# Altium schematic sheet at32f415_soc.SchDoc
size A4; DocumentNumber: 2; SheetNumber: 2; SheetTotal: 4
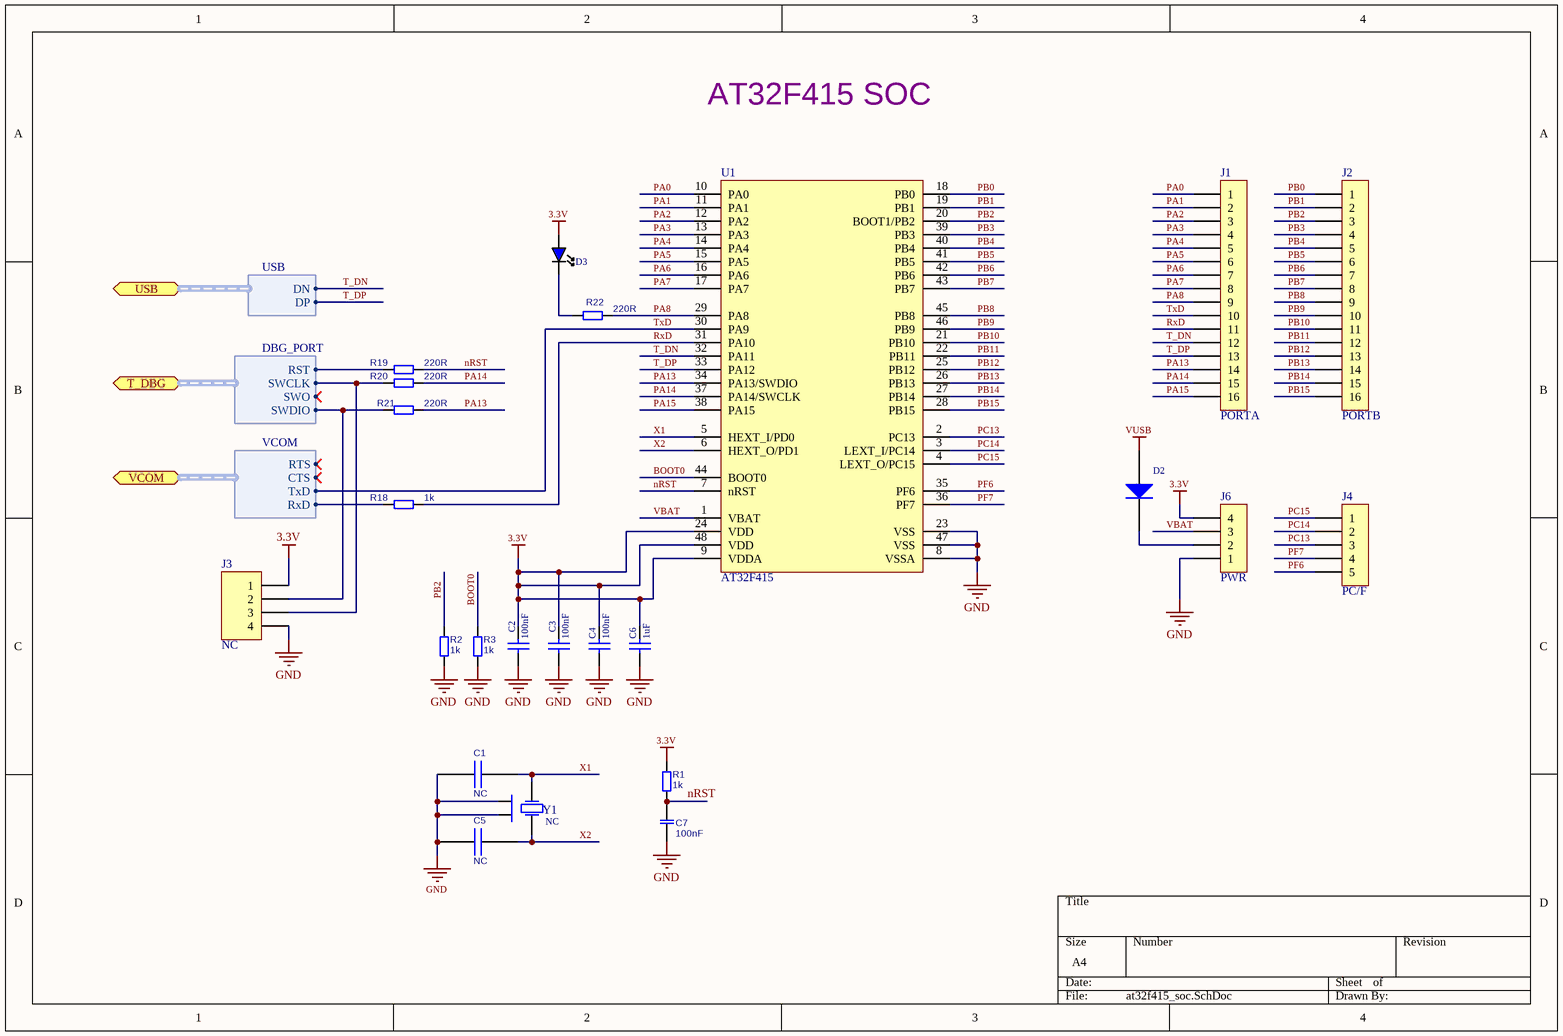
[diagram p0: at32f415_soc.SchDoc]

## Parts
C1  NC  [C0402]  (no BOM)
C2  100nF  [C0402]
C3  100nF  [C0402]
C4  100nF  [C0402]
C5  NC  [C0402]  (no BOM)
C6  1uF  [C0603]
C7  100nF  [C0402]
D2  Diode  [SOD123]  (value not drawn)
D3  User LED  [LED0603]  (value not drawn)
J1  PORTA  [HDR1X16]  (no BOM)
J2  PORTB  [HDR1X16]  (no BOM)
J3  NC  [HDR1X4]  (no BOM)
J4  PC/F  [HDR1X5]  (no BOM)
J6  PWR  [HDR1X4]  (no BOM)
R1  1k  [R0402]
R2  1k  [R0402]
R3  1k  [R0402]
R18  1k  [R0402]
R19  220R  [R0402]
R20  220R  [R0402]
R21  220R  [R0402]
R22  220R  [R0402]
U1  AT32F415  [LQFP48_M]
Y1  NC  [XTAL_3225]  (no BOM)

## Ports
T_DBG (harness DBG_PORT), USB (harness USB), VCOM (harness VCOM)

## Harnesses
DBG_PORT: RST, SWCLK, SWDIO, SWO
VCOM: RTS, CTS, RxD, TxD
USB: DP, DN

## Nets
3.3V: C2.1 C3.1 C4.1 C6.1 D3.A J3.1 J6.4 R1.1(K) U1.9(VDDA) U1.24(VDD) U1.48(VDD)
GND: C1.1(P) C2.2 C3.2 C4.2 C5.1(P) C6.2 C7.1(K) J3.4 J6.1 R2.1(K) R3.2(A) U1.8(VSSA) U1.23(VSS) U1.47(VSS) Y1.2 Y1.4(X2)
VUSB: D2.A
BOOT0: R3.1(K) U1.44(BOOT0)
nRST: C7.2(A) R1.2(A) R19.1(K) U1.7(nRST)
PA0: J1.1 U1.10(PA0)
PA1: J1.2 U1.11(PA1)
PA2: J1.3 U1.12(PA2)
PA3: J1.4 U1.13(PA3)
PA4: J1.5 U1.14(PA4)
PA5: J1.6 U1.15(PA5)
PA6: J1.7 U1.16(PA6)
PA7: J1.8 U1.17(PA7)
PA8: J1.9 R22.1(K) U1.29(PA8)
PA13: J1.14 R21.1(K) U1.34(PA13/SWDIO)
PA14: J1.15 R20.1(K) U1.37(PA14/SWCLK)
PA15: J1.16 U1.38(PA15)
PB0: J2.1 U1.18(PB0)
PB1: J2.2 U1.19(PB1)
PB2: J2.3 R2.2(A) U1.20(BOOT1/PB2)
PB3: J2.4 U1.39(PB3)
PB4: J2.5 U1.40(PB4)
PB5: J2.6 U1.41(PB5)
PB6: J2.7 U1.42(PB6)
PB7: J2.8 U1.43(PB7)
PB8: J2.9 U1.45(PB8)
PB9: J2.10 U1.46(PB9)
PB10: J2.11 U1.21(PB10)
PB11: J2.12 U1.22(PB11)
PB12: J2.13 U1.25(PB12)
PB13: J2.14 U1.26(PB13)
PB14: J2.15 U1.27(PB14)
PB15: J2.16 U1.28(PB15)
PC13: J4.3 U1.2(PC13)
PC14: J4.2 U1.3(LEXT_I/PC14)
PC15: J4.1 U1.4(LEXT_O/PC15)
PF6: J4.5 U1.35(PF6)
PF7: J4.4 U1.36(PF7)
RxD: J1.11 R18.2(A) U1.31(PA10)
T_DN: J1.12 U1.32(PA11) ; port USB.DN
T_DP: J1.13 U1.33(PA12) ; port USB.DP
TxD: J1.10 U1.30(PA9) ; port VCOM.TxD
VBAT: J6.3 U1.1(VBAT)
X1: C1.2(N) U1.5(HEXT_I/PD0) Y1.1(X1)
X2: C5.2(N) U1.6(HEXT_O/PD1) Y1.3(X2)
NetD2_K: D2.K J6.2
NetD3_k: D3.k R22.2(A)
NetJ3_2: J3.2 R21.2(A) ; port T_DBG.SWDIO
NetJ3_3: J3.3 R20.2(A) ; port T_DBG.SWCLK
NetR18_1: R18.1(K) ; port VCOM.RxD
NetR19_2: R19.2(A) ; port T_DBG.RST

## Notes on the sheet
- AT32F415 SOC

## Library data of the parts
C1 C5 = Cap1: Ceramic Capacitor; Type: SMD; ComponentLink1URL: *; ComponentLink1Description: *; Tolerance: *; Value: NC
C2-C4 C6 = Cap: Capacitor; Published: 8-Jun-2000; LatestRevisionDate: 17-Jul-2002; LatestRevisionNote: Re-released for DXP Platform.; PackageReference: RAD-0.3; Publisher: Altium Limited; PackageDescription: Radial Cap, Thru-Hole; 2 Leads; 0.3 in Pin Spacing
  C2-C4: Value: 100nF
  C6: Value: 1uF
C7 = Cap: Ceramic Capacitor; Type: SMD; ComponentLink1URL: *; ComponentLink1Description: *; Tolerance: *; Value: 100nF
D2 = Diode: Generic Diode; Value: *
D3 = LED_BLUE: Green LED; Part Number: 150060VS75020; Value: *
J1 J2 = HEADER1x16: 100mil, 1x16 header
J3 = Header 4: Header, 4-Pin; LatestRevisionDate: 17-Jul-2002; LatestRevisionNote: Re-released for DXP Platform.; Value: NC
J4 = HEADER1X5: 100mil, 1x5 header
J6 = HEADER1X4: 100mil, 1x4 header
R1-R3 R18-R22 = Res: Resistor; ComponentLink1URL: *; ComponentLink1Description: *; Tolerance: *; Type: SMD
  R1-R3 R18: Value: 1k
  R19-R22: Value: 220R
U1 = AT32F415: Cortex-M4 MCU
Y1 = XTAL_4_PIN: 12Mhz CERAMIC SMD CRYSTAL; Value: NC; ComponentLink1Description: DataSheet